# Altium schematic sheet Temperature.SchDoc
size A
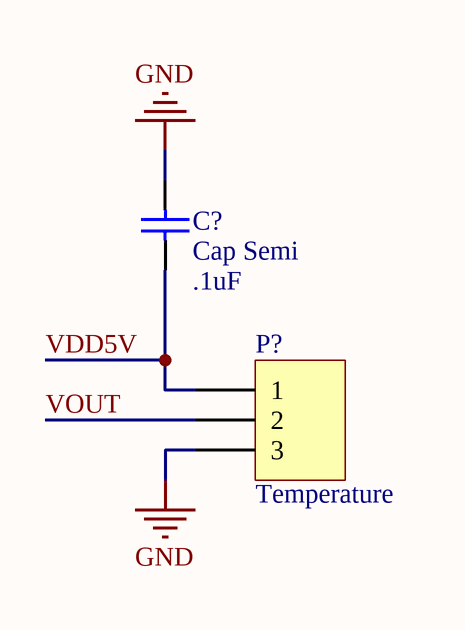
[diagram p0: Temperature.SchDoc]

## Parts
C?  Cap Semi  value .1uF  [C1206]
P?  Temperature  [HDR1X3]

## Nets
GND: C?.2 P?.3
VDD5V: C?.1 P?.1
VOUT: P?.2

## Library data of the parts
C? = Cap Semi: Capacitor (Semiconductor SIM Model); Published: 8-Jun-2000; LatestRevisionDate: 29-May-2009; LatestRevisionNote: IPC-7351 Footprint Added.; PackageReference: C1206; Publisher: Altium Limited; PackageDescription: Chip Capacitor
P? = Header 3: Header, 3-Pin; LatestRevisionDate: 17-Jul-2002; LatestRevisionNote: Re-released for DXP Platform.; Publisher: Altium Limited